# EAGLE design Clock Extension (EAGLE 7.6.0)
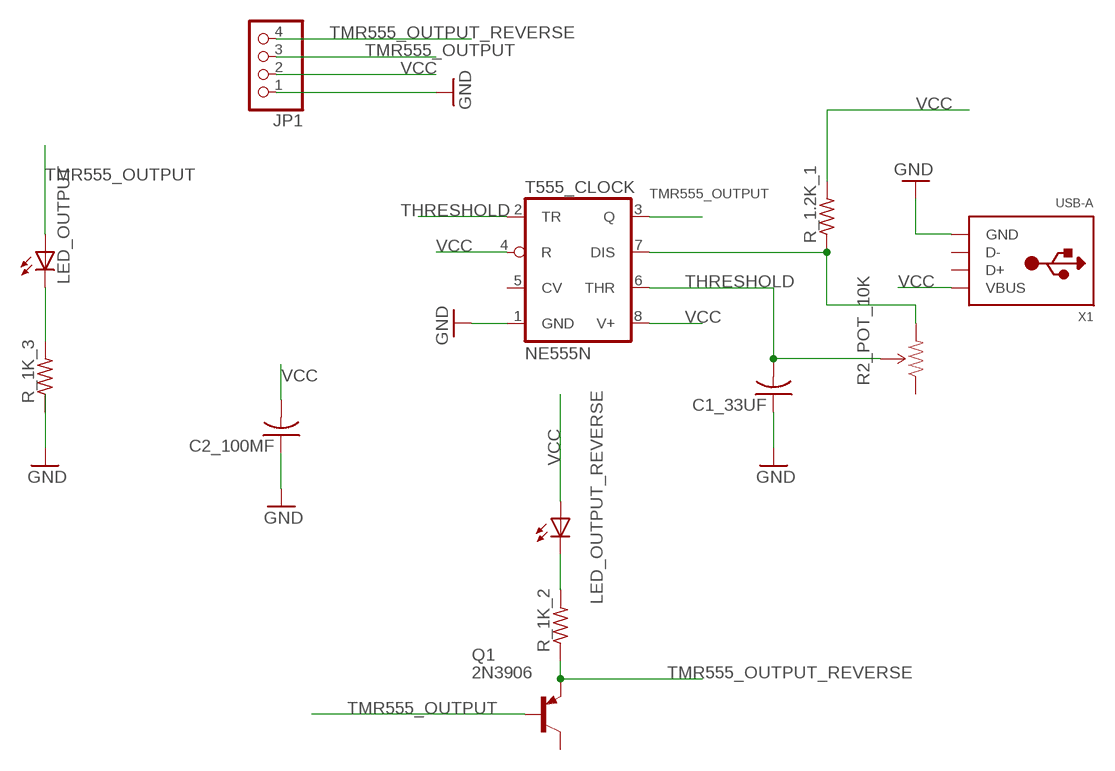
[diagram p0: schematic, sheet 1]

## Parts
C1_33UF  C-US025-030X050  [C025-030X050]
C2_100MF  C-US025-030X050  [C025-030X050]
JP1  PINHD-1X4  [1X04]
LED_OUTPUT  LEDSMT1206  [1206]
LED_OUTPUT_REVERSE  LEDSMT1206  [1206]
Q1  2N3906  [TO92]
R2_POT_10K  TRIMPOTPTH  [TRIM_POT_PTH]
R_1.2K_1  R-US_R1206  [R1206]
R_1K_2  R-US_R1206  [R1206]
R_1K_3  R-US_R1206  [R1206]
T555_CLOCK  NE555N  [DIL08]
X1  USB-A  [MOLEX_480371000]

## Nets
GND: C1_33UF.1 C2_100MF.1 JP1.1 R_1K_3.1 T555_CLOCK.1(GND) X1.4(GND)
N$1: R2_POT_10K.3(CW) R_1.2K_1.1 T555_CLOCK.7(DIS)
N$5: LED_OUTPUT.C R_1K_3.2
N$6: LED_OUTPUT_REVERSE.C R_1K_2.2
THRESHOLD: C1_33UF.2 R2_POT_10K.2(WIPER) T555_CLOCK.2(TR) T555_CLOCK.6(THR)
TMR555_OUTPUT: JP1.3 LED_OUTPUT.A Q1.2(B) T555_CLOCK.3(Q)
TMR555_OUTPUT_REVERSE: JP1.4 Q1.3(E) R_1K_2.1
VCC: C2_100MF.2 JP1.2 LED_OUTPUT_REVERSE.A R_1.2K_1.2 T555_CLOCK.4(R) T555_CLOCK.8(V+) X1.1(VBUS)
Unconnected: Q1.1(C) R2_POT_10K.1(CCW) T555_CLOCK.5(CV) X1.2(D-) X1.3(D+)

## Library data of the parts
C1_33UF C2_100MF = adafruit:C-US: CAPACITOR, American symbol
JP1 = pinhead:PINHD-1X4: PIN HEADER
LED_OUTPUT LED_OUTPUT_REVERSE = adafruit:LED: LED OSRAM: - CHIPLED LG R971, LG N971, LY N971, LG Q971, LY Q971, LO R971, LY R971 LH N974, LH R974 LS Q976, LO Q976, LY Q976 LO Q996 - Hyper CHIPLED LW Q18S LB Q993, LB Q99A, LB R99A - SideLED LS A670, LO A670, LY A670, LG A670, LP A670 LB A673, LV A673, LT A673, LW A673 LH A674 LY A675 LS A676, LA A676, LO A676, LY A676, LW A676 LS A679, LY A679, LG A679 - Hyper Micro SIDELED® LS Y876, LA Y876, LO Y876, LY Y876 LT Y87S - SmartLED LW L88C, LW L88S LB L89C, LB L89S, LG L890 LS L89K, LO L89K, LY L89K LS L896, LA L896, LO L896, LY L896 - TOPLED LS T670, LO T670, LY T670, LG T670, LP T670 LSG T670, LSP T670, LSY T670, LOP T670, LYG T670 LG T671, LOG T671, LSG T671 LB T673, LV T673, LT T673, LW T673 LH T674 LS T676, LA T676, LO T676, LY T676, LB T676, LH T676, LSB T676, LW T676 LB T67C, LV T67C, LT T67C, LS T67K, LO T67K, LY T67K, LW E67C LS E67B, LA E67B, LO E67B, LY E67B, LB E67C, LV E67C, LT E67C LW T67C LS T679, LY T679, LG T679 LS T770, LO T770, LY T770, LG T770, LP T770 LB T773, LV T773, LT T773, LW T773 LH T774 LS E675, LA E675, LY E675, LS T675 LS T776, LA T776, LO T776, LY T776, LB T776 LHGB T686 LT T68C, LB T68C - Hyper Mini TOPLED® LB M676 - Mini TOPLED Santana® LG M470 LS M47K, LO M47K, LY M47K Source: http://www.osram.convergy.de/
Q1 = transistor-pnp:2N3906: PNP Transistor
R2_POT_10K = SparkFun-Electromechanical:TRIMPOT: Various small potentiometers for "set-and-forget" applications
R_1.2K_1 R_1K_2 R_1K_3 = adafruit:R-US_: RESISTOR, American symbol
T555_CLOCK = linear:*555: TIMER
X1 = adafruit:USB-A: USB type A 'plug' Used for things that can directly connect to a USB port, say USB key

## Board
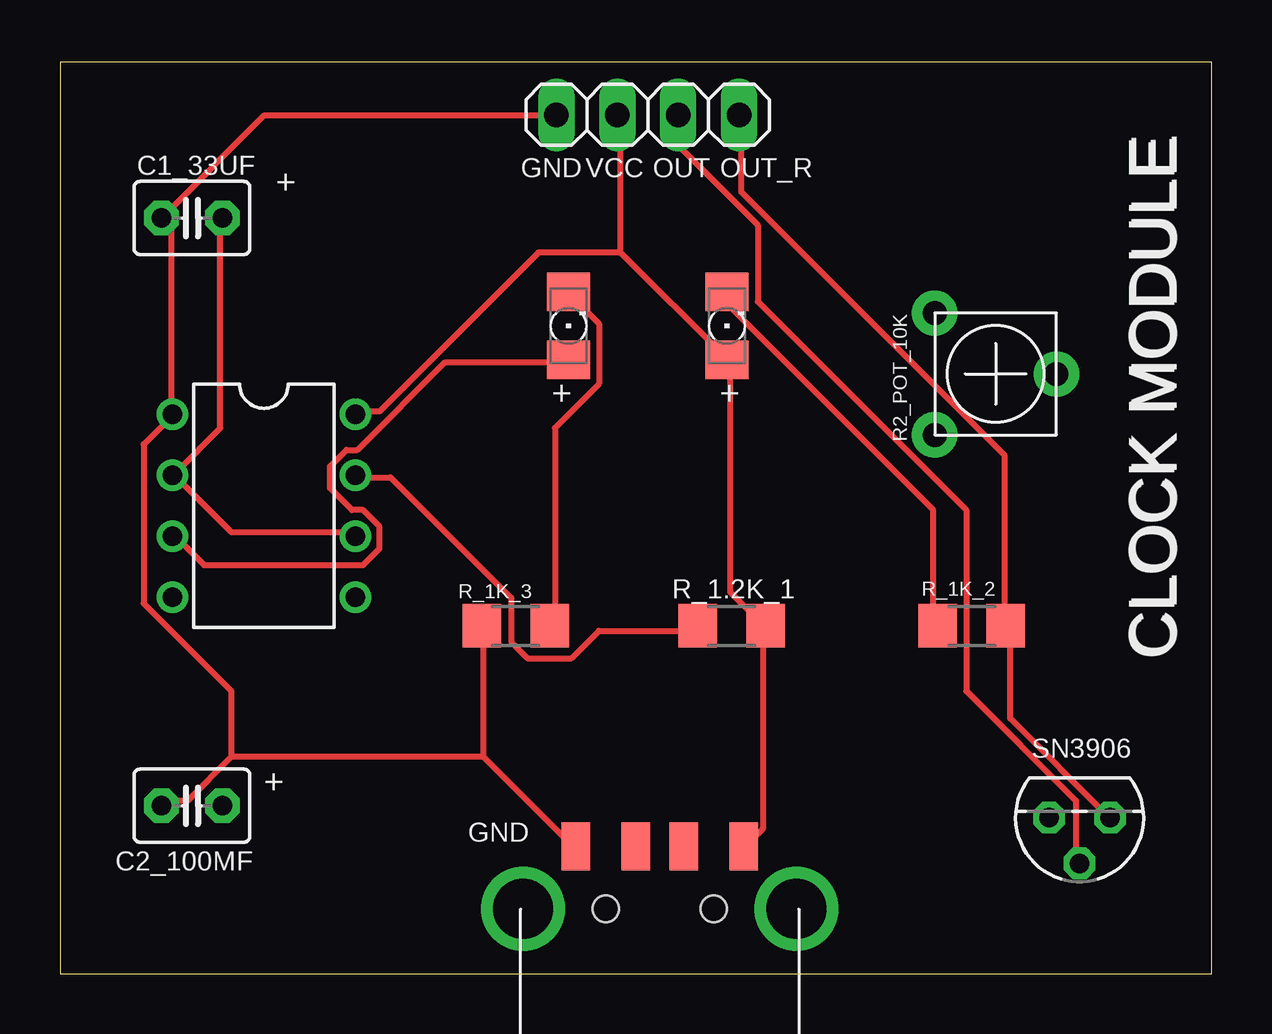
[diagram p1: board, top side]
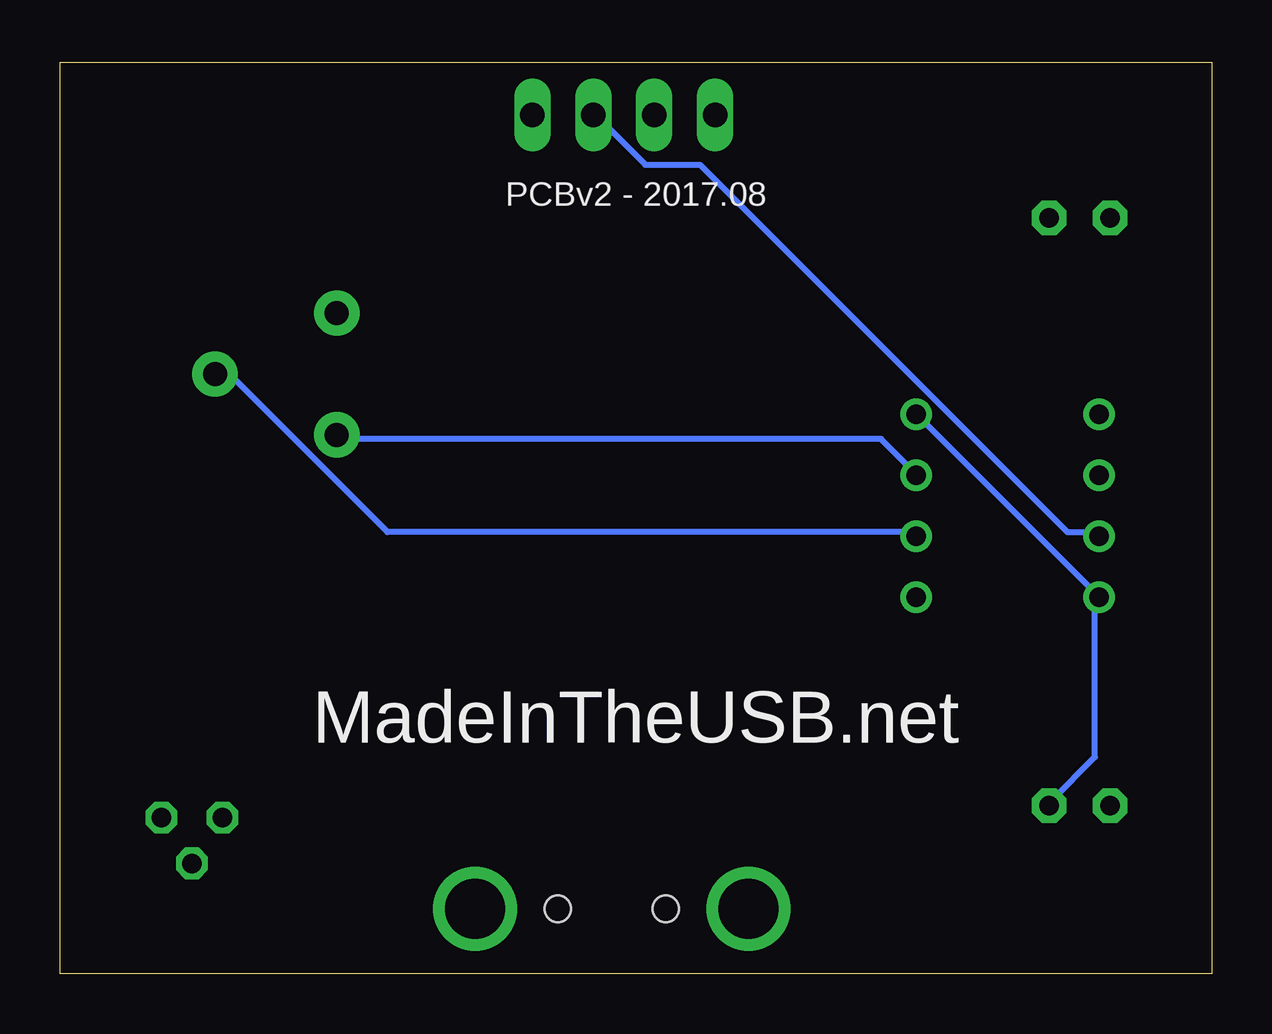
[diagram p2: board, bottom side, seen from below]

Size 48 x 38 mm. Coordinates in mm from the lower left corner, seen from the top.
Outline: 0,0 48,0 48,38 0,38 0,0
Copper layers (1*16): Top 0.035mm / dielectric 1.5mm / Bottom 0.035mm
Design rules "default": minimum track width 10mil, minimum drill 24mil, track to track 8mil, track to pad 8mil, pad to pad 8mil, via to via 8mil, smd to smd 8mil, copper to edge 40mil, drill to drill 8mil, minimum pad ring 10mil, minimum via ring 8mil, stop-mask expansion 4mil, vias tented up to drill 0mil, thermal gap 10mil

### Footprints (pad centres in the part's own frame; a part is rotated, then mirrored left to right if it is on the bottom)
C025-030X050 = drill 0.813 pad 1.422 octagon: 1 -1.27,0; 2 1.27,0
1X04 = drill 1.016 long: 1 -3.81,0; 2 -1.27,0; 3 1.27,0; 4 3.81,0
1206 = smd 1.6 x 1.803: A -1.422,0; C 1.422,0
TO92 = drill 0.813 octagon: 1 1.27,0; 2 0,1.905; 3 -1.27,0
TRIM_POT_PTH = drill 1 pad 1.88: 1 -2.54,-2.54; 2 0,2.54; 3 2.54,-2.54
R1206 = smd 1.6 x 1.803: 1 -1.422,0; 2 1.422,0
DIL08 = drill 0.813 pad 1.27: 1 -3.81,-3.81; 2 -1.27,-3.81; 3 1.27,-3.81; 4 3.81,-3.81; 5 3.81,3.81; 6 1.27,3.81; 7 -1.27,3.81; 8 -3.81,3.81
MOLEX_480371000 = smd 1.2 x 2: 1 3.5,2.6; 2 1,2.6; 3 -1,2.6; 4 -3.5,2.6 | drill 2.5: M1 -5.7,0; M2 5.7,0 | hole 1.1: -2.25,0; 2.25,0

### Placement (x,y rotation side)
C1_33UF  5.5,31.5 0 top
C2_100MF  5.5,7 0 top
JP1  24.5,35.8 0 top
LED_OUTPUT  21.2,27 90 top
LED_OUTPUT_REVERSE  27.8,27 90 top
Q1  42.5,6.5 180 top
R2_POT_10K  39,25 270 top
R_1.2K_1  28,14.5 0 top
R_1K_2  38,14.5 180 top
R_1K_3  19,14.5 0 top
T555_CLOCK  8.5,19.5 270 top
X1  25,2.7 0 top

### Tracks (layer width: path | path; a pad name or v marks a point on that pad's centre or on a via)
GND
  Top 0.254: 17.66,9.03 17.66,14.29 R_1K_3.1 | 17.66,9.03 21.32,5.37 X1.4 | 7.14,9.03 5.32,7.2 4.4,7.2 C2_100MF.1 | 17.66,9.03 7.14,9.03 | JP1.1 20.63,35.78 8.52,35.78 4.4,31.66 C1_33UF.1 4.4,31.43 4.63,31.2 4.63,23.43 T555_CLOCK.1 4.63,23.2 3.49,22.06 3.49,15.43 7.14,11.77 7.14,9.03
N$1
  Top 0.254: R_1.2K_1.1 26.57,14.29 22.46,14.29 21.32,13.15 19.49,13.15 18.8,13.83 18.8,15.66 13.77,20.69 12.4,20.69 T555_CLOCK.7
  Bottom 0.254: R2_POT_10K.3 36.41,22.29 13.77,22.29 12.4,20.92 T555_CLOCK.7
N$5
  Top 0.254: R_1K_3.2 20.63,14.52 20.63,22.75 22.46,24.58 22.46,27.09 21.32,28.23 LED_OUTPUT.C
N$6
  Top 0.254: LED_OUTPUT_REVERSE.C 27.95,28.23 27.95,27.78 36.41,19.32 36.41,14.52 R_1K_2.2
THRESHOLD
  Top 0.254: T555_CLOCK.6 12.17,18.4 7.14,18.4 4.86,20.69 T555_CLOCK.2 4.86,20.92 6.69,22.75 6.69,31.43 C1_33UF.2
  Bottom 0.254: R2_POT_10K.2 41.43,24.8 40.75,24.8 34.35,18.4 12.4,18.4 T555_CLOCK.6
TMR555_OUTPUT
  Top 0.254: LED_OUTPUT.A 21.09,25.49 16.06,25.49 12.4,21.83 11.95,21.83 11.26,21.15 11.26,20.23 12.17,19.32 12.63,19.32 13.32,18.63 13.32,17.72 12.63,17.03 6,17.03 4.86,18.18 T555_CLOCK.3 | Q1.2 42.35,4.69 42.35,7.2 37.78,11.77 37.78,19.32 29.09,28.01 29.09,31.2 25.89,34.41 25.89,35.78 JP1.3
  Bottom 0.254: T555_CLOCK.3 4.86,18.4 6,18.4 21.32,33.72 23.6,33.72 25.66,35.78 JP1.3
TMR555_OUTPUT_REVERSE
  Top 0.254: Q1.3 43.72,6.52 39.6,10.63 39.6,14.29 R_1K_2.1 39.38,14.52 39.38,21.6 28.4,32.58 28.4,35.78 JP1.4
VCC
  Top 0.254: X1.1 28.63,5.37 29.32,6.06 29.32,14.29 R_1.2K_1.2 29.32,14.52 27.95,15.89 27.95,25.49 LED_OUTPUT_REVERSE.A 27.72,25.72 23.38,30.06 | 23.38,30.06 23.38,35.78 JP1.2 | 23.38,30.06 19.95,30.06 13.32,23.43 12.4,23.43 T555_CLOCK.8
  Bottom 0.254: C2_100MF.2 6.69,7.2 4.86,9.03 4.86,15.66 T555_CLOCK.4 4.86,15.89 12.17,23.2 T555_CLOCK.8

### Text on the board
tNames: GND | VCC | OUT | OUT_R | + | + | + | CLOCK MODULE | CLOCK MODULE | SN3906 | + | GND
bNames: PCBv2 - 2017.08 | MadeInTheUSB.net